# Altium project BPQ.PrjPcb
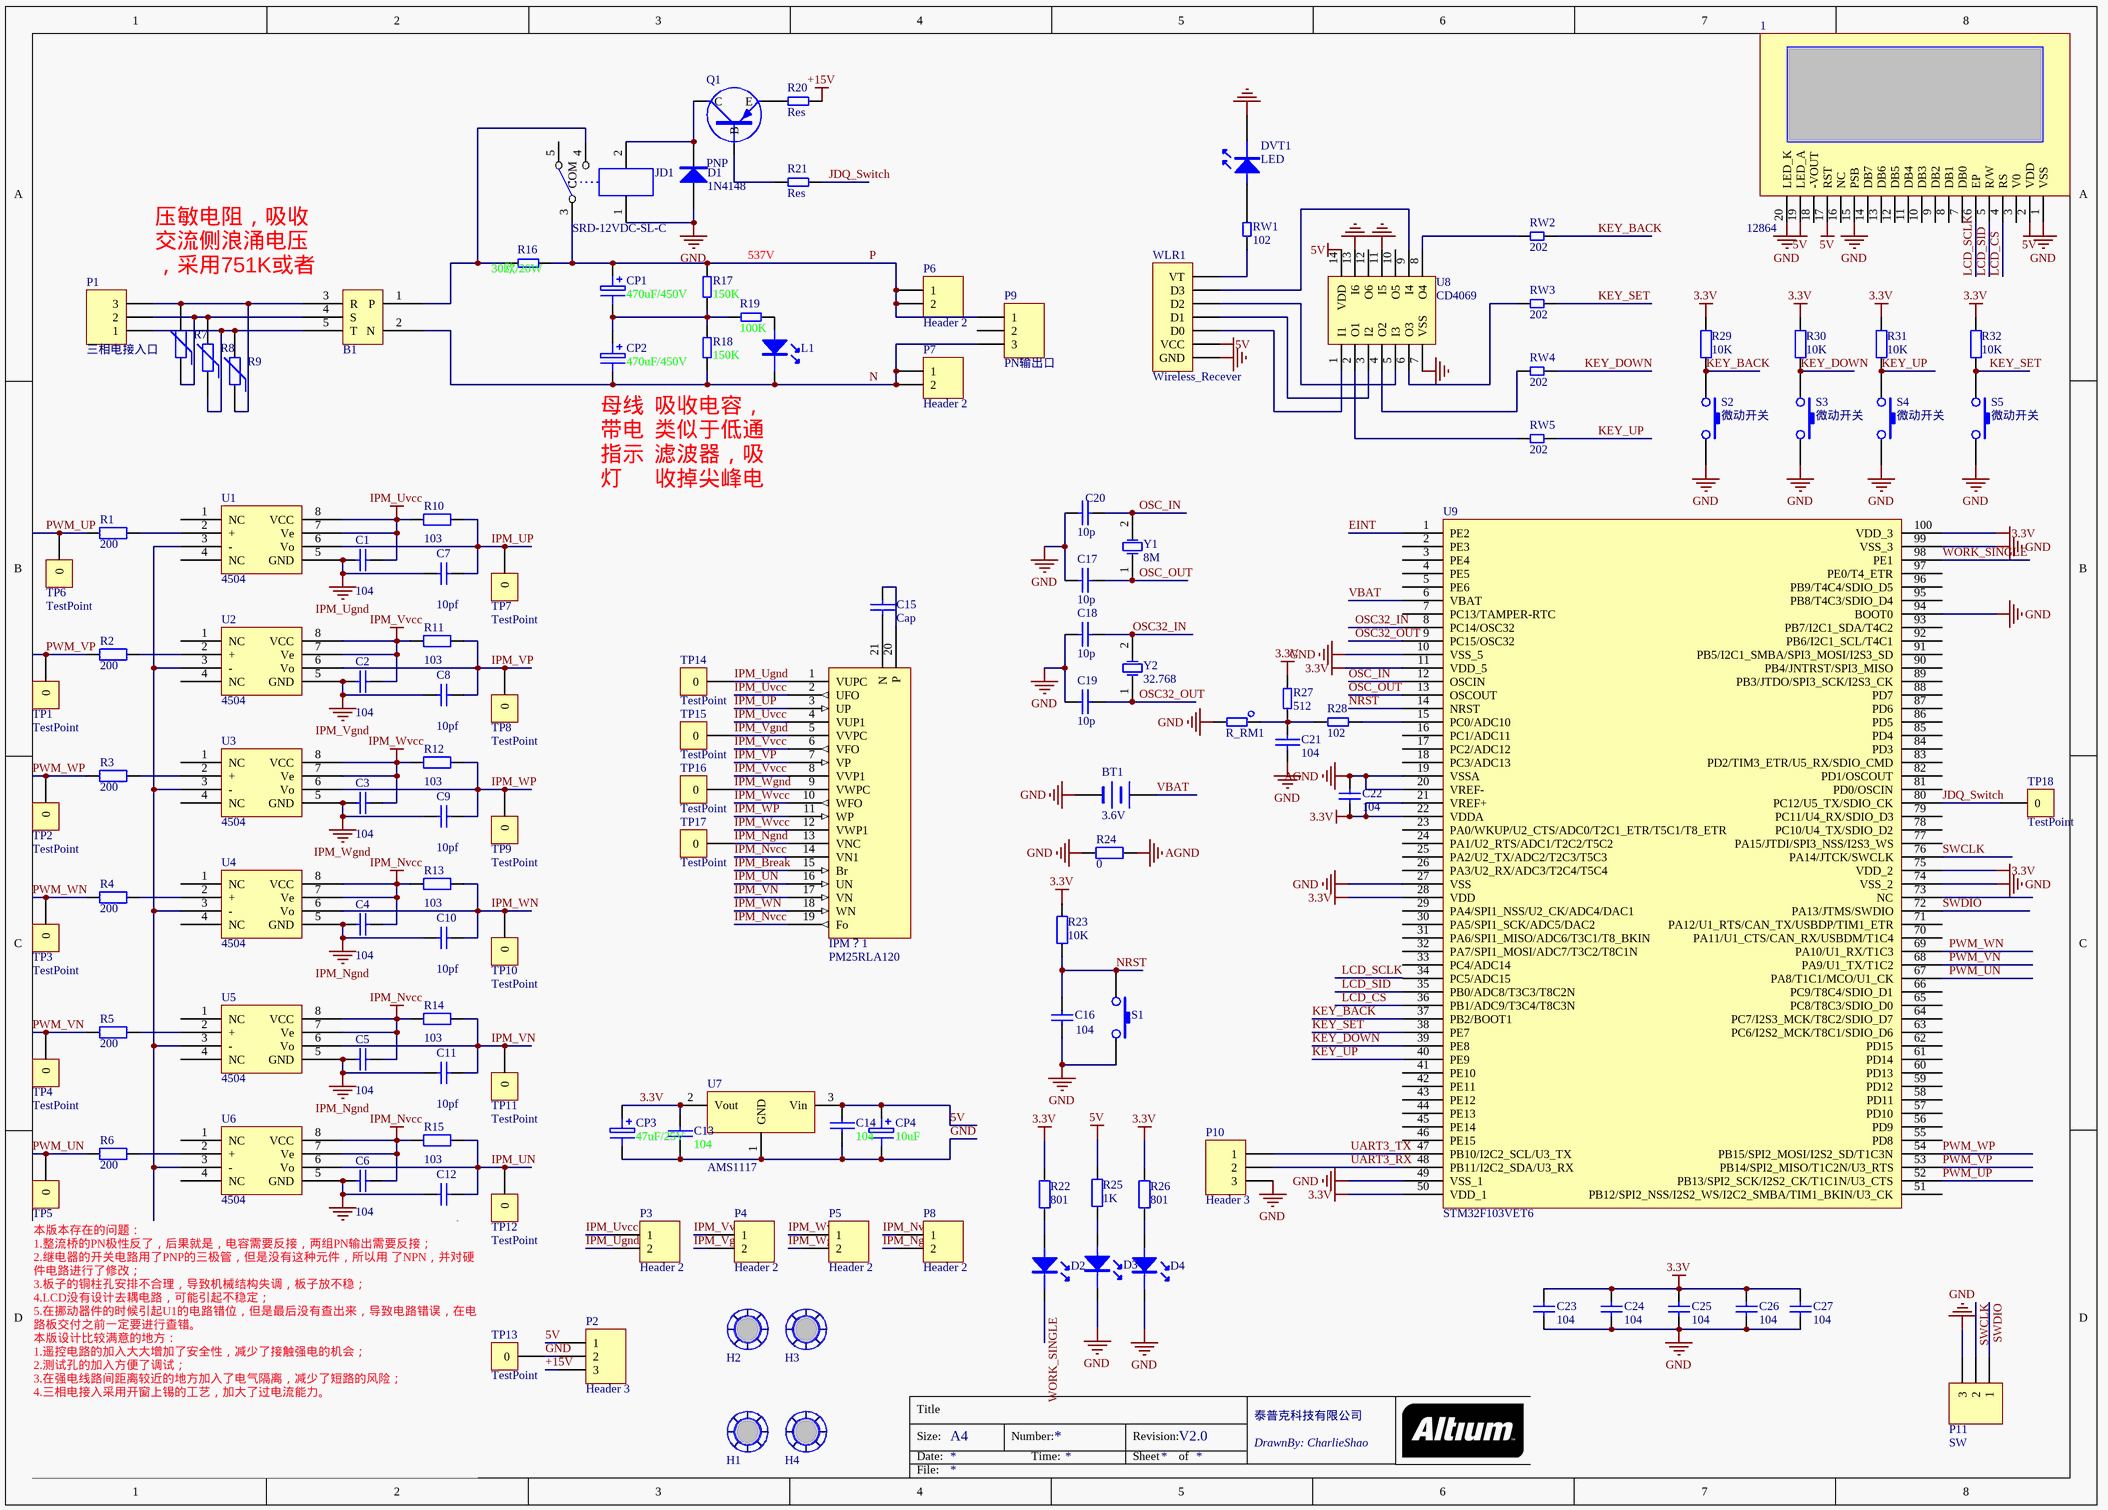
[diagram p0: BPQ.SchDoc]
1 sheet, 131 parts. Net scope: global (net labels, ports and power ports of the same name join across sheets).
Board file: BPQ.PcbDoc

## Sheet BPQ.SchDoc
size A3; Address1: 泰普克科技有限公司; Address3: DrawnBy: CharlieShao; Revision: V2.0; ProjectName: BPQ

### Parts
1  12864  [YX12864B]
B1  3BRIDGE  [三相整流桥]  (value not drawn)
BT1  3.6V  [CR1220]
C1  value 104  [0805C]  (hidden comment: Cap)
C2  value 104  [0805C]  (hidden comment: Cap)
C3  value 104  [0805C]  (hidden comment: Cap)
C4  value 104  [0805C]  (hidden comment: Cap)
C5  value 104  [0805C]  (hidden comment: Cap)
C6  value 104  [0805C]  (hidden comment: Cap)
C7  value 10pf  [0805C]  (hidden comment: Cap)
C8  value 10pf  [0805C]  (hidden comment: Cap)
C9  value 10pf  [0805C]  (hidden comment: Cap)
C10  value 10pf  [0805C]  (hidden comment: Cap)
C11  value 10pf  [0805C]  (hidden comment: Cap)
C12  value 10pf  [0805C]  (hidden comment: Cap)
C13  104  [0805C]
C14  104  [0805C]
C15  Cap  [Cap_X]
C16  104  [0805C]
C17  10p  [0805C]
C18  10p  [0805C]
C19  10p  [0805C]
C20  10p  [0805C]
C21  104  [0805C]
C22  104  [0805C]
C23  104  [0805C]
C24  104  [0805C]
C25  104  [0805C]
C26  104  [0805C]
C27  104  [0805C]
CP1  470uF/450V  [CAP_35X50]
CP2  470uF/450V  [CAP_35X50]
CP3  47uF/25V  [CAP_6.3X5.4]
CP4  10uF  [CAP_6.3X5.4]
D1  1N4148  [Diode_1206]
D2  LED  [LED_0805]  (value not drawn)
D3  LED  [LED_0805]  (value not drawn)
D4  LED  [LED_0805]  (value not drawn)
DVT1  LED  [LED_1206]
H1  铜柱孔  [HOLE]  (value not drawn)
H2  铜柱孔  [HOLE]  (value not drawn)
H3  铜柱孔  [HOLE]  (value not drawn)
H4  铜柱孔  [HOLE]  (value not drawn)
IPM？1  PM25RLA120  [PM25RLA120]
JD1  SRD-12VDC-SL-C  [SRD-12VDC-SL-C]
L1  LED  [LED_1206]  (value not drawn)
P1  三相电接入口  [30A/300V]
P2  Header 3  [HDR1X3]
P3  Header 2  [HDR1X2]
P4  Header 2  [HDR1X2]
P5  Header 2  [HDR1X2]
P6  Header 2  [HDR1X2]
P7  Header 2  [HDR1X2]
P8  Header 2  [HDR1X2]
P9  PN输出口  [30A/300V]
P10  Header 3  [HDR1X3]
P11  SW  [HDR1X3H]
Q1  PNP  [SOT23]
R1  value 200  [0805R]  (hidden comment: Res2)
R2  value 200  [0805R]  (hidden comment: Res2)
R3  value 200  [0805R]  (hidden comment: Res2)
R4  value 200  [0805R]  (hidden comment: Res2)
R5  value 200  [0805R]  (hidden comment: Res2)
R6  value 200  [0805R]  (hidden comment: Res2)
R7  Res Varistor  [R_VDR]  (value not drawn)
R8  Res Varistor  [R_VDR]  (value not drawn)
R9  Res Varistor  [R_VDR]  (value not drawn)
R10  value 103  [0805R]  (hidden comment: Res2)
R11  value 103  [0805R]  (hidden comment: Res2)
R12  value 103  [0805R]  (hidden comment: Res2)
R13  value 103  [0805R]  (hidden comment: Res2)
R14  value 103  [0805R]  (hidden comment: Res2)
R15  value 103  [0805R]  (hidden comment: Res2)
R16  30欧/20W  [R_30R/20W]
R17  150K  [AXIAL0.7]
R18  150K  [AXIAL0.7]
R19  100K  [0805R]
R20  Res  [0805R]
R21  Res  [0805R]
R22  801  [0805R]
R23  10K  [0805R]
R24  0  [0805R]
R25  1K  [0805R]
R26  801  [0805R]
R27  512  [0805R]
R28  102  [0805R]
R29  10K  [0805R]
R30  10K  [0805R]
R31  10K  [0805R]
R32  10K  [0805R]
R_RM1  热敏电阻  [R_RM]  (value not drawn)
RW1  102  [0805R]
RW2  202  [0805R]
RW3  202  [0805R]
RW4  202  [0805R]
RW5  202  [0805R]
S1  KEY  [SW_PB - 6.5x4.5]  (value not drawn)
S2  微动开关  [SW_PB - 6.5x4.5]
S3  微动开关  [SW_PB - 6.5x4.5]
S4  微动开关  [SW_PB - 6.5x4.5]
S5  微动开关  [SW_PB - 6.5x4.5]
TP1  TestPoint  [TEST-POINT]
TP2  TestPoint  [TEST-POINT]
TP3  TestPoint  [TEST-POINT]
TP4  TestPoint  [TEST-POINT]
TP5  TestPoint  [TEST-POINT]
TP6  TestPoint  [TEST-POINT]
TP7  TestPoint  [TEST-POINT]
TP8  TestPoint  [TEST-POINT]
TP9  TestPoint  [TEST-POINT]
TP10  TestPoint  [TEST-POINT]
TP11  TestPoint  [TEST-POINT]
TP12  TestPoint  [TEST-POINT]
TP13  TestPoint  [TEST-POINT]
TP14  TestPoint  [TEST-POINT]
TP15  TestPoint  [TEST-POINT]
TP16  TestPoint  [TEST-POINT]
TP17  TestPoint  [TEST-POINT]
TP18  TestPoint  [TEST-POINT]
U1  4504  [DIP-8]
U2  4504  [DIP-8]
U3  4504  [DIP-8]
U4  4504  [DIP-8]
U5  4504  [DIP-8]
U6  4504  [DIP-8]
U7  AMS1117  [SOT223]
U8  CD4069  [SO-14]
U9  STM32F103VET6  [LQFP100]
WLR1  Wireless_Recever  [Wireless_Recever]
Y1  8M  [XTAL2]
Y2  32.768  [XTAL1]

### Nets
3.3V: C13.2 C22.2 C23.1 C24.1 C25.1 C26.1 C27.1 CP3.1 R22.1 R23.2 R26.1 R27.1 R29.2 R30.2 R31.2 R32.2 U7.2(Vout) U9.11(VDD_5) U9.21(VREF+) U9.22(VDDA) U9.28(VDD) U9.50(VDD_1) U9.75(VDD_2) U9.100(VDD_3)
5V: 1.2(VDD) 1.17(RST) 1.19(LED_A) C14.2 CP4.1 P2.1 R25.1 U7.3(Vin) U8.14(VDD) WLR1.2(VCC)
+15V: P2.3 R20.2
AGND: C22.1 R24.1 U9.19(VSSA) U9.20(VREF-)
GND: 1.1(VSS) 1.15(PSB) 1.20(LED_K) BT1.2(-) C13.1 C14.1 C16.1 C17.1 C18.1 C19.1 C20.1 C21.1 C23.2 C24.2 C25.2 C26.2 C27.2 CP3.2 CP4.2 D1.1 D3.2 D4.2 DVT1.2 JD1.1 P2.2 P10.3 P11.3 R24.2 R_RM1.1 S1.2 S2.2 S3.2 S4.2 S5.2 TP13.0 U1.3(-) U2.3(-) U3.3(-) U4.3(-) U5.3(-) U6.3(-) U7.1(GND) U8.7(VSS) U8.11(I5) U8.13(I6) U9.10(VSS_5) U9.27(VSS) U9.49(VSS_1) U9.74(VSS_2) U9.94(BOOT0) U9.99(VSS_3) WLR1.1(GND)
IPM_Ngnd: C4.1 C5.1 C6.1 C10.1 C11.1 C12.1 IPM？1.13(VNC) P8.2 TP17.0 U4.5(GND) U5.5(GND) U6.5(GND)
IPM_Nvcc: C4.2 C5.2 C6.2 IPM？1.14(VN1) IPM？1.19(Fo) P8.1 R13.1 R14.1 R15.1 U4.7(Ve) U4.8(VCC) U5.7(Ve) U5.8(VCC) U6.7(Ve) U6.8(VCC)
IPM_Ugnd: C1.1 C7.1 IPM？1.1(VUPC) P3.2 TP14.0 U1.5(GND)
IPM_Uvcc: C1.2 IPM？1.2(UFO) IPM？1.4(VUP1) P3.1 R10.1 U1.7(Ve) U1.8(VCC)
IPM_Vgnd: C2.1 C8.1 IPM？1.5(VVPC) P4.2 TP15.0 U2.5(GND)
IPM_Vvcc: C2.2 IPM？1.6(VFO) IPM？1.8(VVP1) P4.1 R11.1 U2.7(Ve) U2.8(VCC)
IPM_Wgnd: C3.1 C9.1 IPM？1.9(VWPC) P5.2 TP16.0 U3.5(GND)
IPM_Wvcc: C3.2 IPM？1.10(WFO) IPM？1.12(VWP1) P5.1 R12.1 U3.7(Ve) U3.8(VCC)
EINT: U9.1(PE2)
IPM_Break: IPM？1.15(Br)
IPM_UN: C12.2 IPM？1.16(UN) R15.2 TP12.0 U6.6(Vo)
IPM_UP: C7.2 IPM？1.3(UP) R10.2 TP7.0 U1.6(Vo)
IPM_VN: C11.2 IPM？1.17(VN) R14.2 TP11.0 U5.6(Vo)
IPM_VP: C8.2 IPM？1.7(VP) R11.2 TP8.0 U2.6(Vo)
IPM_WN: C10.2 IPM？1.18(WN) R13.2 TP10.0 U4.6(Vo)
IPM_WP: C9.2 IPM？1.11(WP) R12.2 TP9.0 U3.6(Vo)
JDQ_Switch: R21.2 TP18.0 U9.80(PC12/U5_TX/SDIO_CK)
KEY_BACK: R29.1 RW2.1 S2.1 U9.37(PB2/BOOT1)
KEY_DOWN: R30.1 RW4.1 S3.1 U9.39(PE8)
KEY_SET: R32.1 RW3.1 S5.1 U9.38(PE7)
KEY_UP: R31.1 RW5.1 S4.1 U9.40(PE9)
LCD_CS: 1.4(RS) U9.36(PB1/ADC9/T3C4/T8C3N)
LCD_SCLK: 1.6(EP) U9.34(PC5/ADC15)
LCD_SID: 1.5(R/W) U9.35(PB0/ADC8/T3C3/T8C2N)
N: B1.2(N) CP2.2 L1.2 P7.1 P7.2 P9.3 R18.1
NRST: C16.2 R23.1 S1.1 U9.14(NRST)
OSC32_IN: C18.2 U9.8(PC14/OSC32) Y2.2(OSC2)
OSC32_OUT: C19.2 U9.9(PC15/OSC32) Y2.1(OSC1)
OSC_IN: C20.2 U9.12(OSCIN) Y1.2(OSC2)
OSC_OUT: C17.2 U9.13(OSCOUT) Y1.1(OSC1)
P: CP1.1 JD1.3(COM) P6.1 P6.2 P9.1 R16.2 R17.2
PWM_UN: R6.1 TP5.0 U9.67(PA8/T1C1/MCO/U1_CK)
PWM_UP: R1.1 TP6.0 U9.52(PB13/SPI2_SCK/I2S2_CK/T1C1N/U3_CTS)
PWM_VN: R5.1 TP4.0 U9.68(PA9/U1_TX/T1C2)
PWM_VP: R2.1 TP1.0 U9.53(PB14/SPI2_MISO/T1C2N/U3_RTS)
PWM_WN: R4.1 TP3.0 U9.69(PA10/U1_RX/T1C3)
PWM_WP: R3.1 TP2.0 U9.54(PB15/SPI2_MOSI/I2S2_SD/T1C3N)
SWCLK: P11.2 U9.76(PA14/JTCK/SWCLK)
SWDIO: P11.1 U9.72(PA13/JTMS/SWDIO)
UART3_RX: P10.2 U9.48(PB11/I2C2_SDA/U3_RX)
UART3_TX: P10.1 U9.47(PB10/I2C2_SCL/U3_TX)
VBAT: BT1.1(+) U9.6(VBAT)
WORK_SINGLE: D2.2 U9.98(PE1)
NetB1_1: B1.1(P) JD1.4 R16.1
NetB1_3: B1.3(R) P1.3 R7.2 R9.1
NetB1_4: B1.4(S) P1.2 R7.1 R8.2
NetB1_5: B1.5(T) P1.1 R8.1 R9.2
NetC15_1: C15.1 IPM？1.20(P)
NetC15_2: C15.2 IPM？1.21(N)
NetC21_2: C21.2 R27.2 R28.2 R_RM1.2
NetCP1_2: CP1.2 CP2.1 R17.1 R18.2 R19.2
NetD1_2: D1.2 JD1.2 Q1.C
NetD2_1: D2.1 R22.2
NetD3_1: D3.1 R25.2
NetD4_1: D4.1 R26.2
NetDVT1_1: DVT1.1 RW1.2
NetL1_1: L1.1 R19.1
NetQ1_B: Q1.B R21.1
NetQ1_E: Q1.E R20.1
NetR1_2: R1.2 U1.2(+)
NetR2_2: R2.2 U2.2(+)
NetR3_2: R3.2 U3.2(+)
NetR4_2: R4.2 U4.2(+)
NetR5_2: R5.2 U5.2(+)
NetR6_2: R6.2 U6.2(+)
NetR28_1: R28.1 U9.15(PC0/ADC10)
NetRW1_1: RW1.1 WLR1.7(VT)
NetRW2_2: RW2.2 U8.8(O4)
NetRW3_2: RW3.2 U8.6(O3)
NetRW4_2: RW4.2 U8.4(O2)
NetRW5_2: RW5.2 U8.2(O1)
NetU8_1: U8.1(I1) WLR1.3(D0)
NetU8_3: U8.3(I2) WLR1.4(D1)
NetU8_5: U8.5(I3) WLR1.5(D2)
NetU8_9: U8.9(I4) WLR1.6(D3)

Not connected (* = marked no-connect by the designer): 1 3(V0) 7(DB0) 8(DB1) 9(DB2) 10(DB3) 11(DB4) 12(DB5) 13(DB6) 14(DB7) 16(NC) 18(-VOUT); H1 0; H2 0; H3 0; H4 0; JD1 5; P9 2; U1 1(NC) 4(NC); U2 1(NC) 4(NC); U3 1(NC) 4(NC); U4 1(NC) 4(NC); U5 1(NC) 4(NC); U6 1(NC) 4(NC); U8 10(O5) 12(O6); U9 2(PE3) 3(PE4) 4(PE5) 5(PE6) 7(PC13/TAMPER-RTC) 16(PC1/ADC11) 17(PC2/ADC12) 18(PC3/ADC13) 23(PA0/WKUP/U2_CTS/ADC0/T2C1_ETR/T5C1/T8_ETR) 24(PA1/U2_RTS/ADC1/T2C2/T5C2) 25(PA2/U2_TX/ADC2/T2C3/T5C3) 26(PA3/U2_RX/ADC3/T2C4/T5C4) 29(PA4/SPI1_NSS/U2_CK/ADC4/DAC1) 30(PA5/SPI1_SCK/ADC5/DAC2) 31(PA6/SPI1_MISO/ADC6/T3C1/T8_BKIN) 32(PA7/SPI1_MOSI/ADC7/T3C2/T8C1N) 33(PC4/ADC14) 41(PE10) 42(PE11) 43(PE12) 44(PE13) 45(PE14) 46(PE15) 51(PB12/SPI2_NSS/I2S2_WS/I2C2_SMBA/TIM1_BKIN/U3_CK) 55(PD8) 56(PD9) 57(PD10) 58(PD11) 59(PD12) 60(PD13) 61(PD14) 62(PD15) 63(PC6/I2S2_MCK/T8C1/SDIO_D6) 64(PC7/I2S3_MCK/T8C2/SDIO_D7) 65(PC8/T8C3/SDIO_D0) 66(PC9/T8C4/SDIO_D1) 70(PA11/U1_CTS/CAN_RX/USBDM/T1C4) 71(PA12/U1_RTS/CAN_TX/USBDP/TIM1_ETR) 73(NC) 77(PA15/JTDI/SPI3_NSS/I2S3_WS) 78(PC10/U4_TX/SDIO_D2) 79(PC11/U4_RX/SDIO_D3) 81(PD0/OSCIN) 82(PD1/OSCOUT) 83(PD2/TIM3_ETR/U5_RX/SDIO_CMD) 84(PD3) 85(PD4) 86(PD5) 87(PD6) 88(PD7) 89(PB3/JTDO/SPI3_SCK/I2S3_CK) 90(PB4/JNTRST/SPI3_MISO) 91(PB5/I2C1_SMBA/SPI3_MOSI/I2S3_SD) 92(PB6/I2C1_SCL/T4C1) 93(PB7/I2C1_SDA/T4C2) 95(PB8/T4C3/SDIO_D4) 96(PB9/T4C4/SDIO_D5) 97(PE0/T4_ETR)

### Notes on the sheet
- 压敏电阻，吸收交流侧浪涌电压，采用751K或者821K
- 537V
- (near CP2) 母线带电指示灯
- 吸收电容，类似于低通滤波器，吸收掉尖峰电压。
- 本版本存在的问题：
  1.整流桥的PN极性反了，后果就是，电容需要反接，两组PN输出需要反接；
  2.继电器的开关电路用了PNP的三极管，但是没有这种元件，所以用 了NPN，并对硬件电路进行了修改；
  3.板子的铜柱孔安排不合理，导致机械结构失调，板子放不稳；
  4.LCD没有设计去耦电路，可能引起不稳定；
  5.在挪动器件的时候引起U1的电路错位，但是最后没有查出来，导致电路错误，在电路板交付之前一定要进行查错。
  本版设计比较满意的地方：
  1.遥控电路的加入大大增加了安全性，减少了接触强电的机会；
  2.测试孔的加入方便了调试；
  3.在强电线路间距离较近的地方加入了电气隔离，减少了短路的风险；
  4.三相电接入采用开窗上锡的工艺，加大了过电流能力。
- Title
- Size:
- Date:
- A4
- Number:
- Time:
- Revision:
- Sheet
- of
- File:

### Library data of the parts
B1 = 三相整流桥
BT1 = BATTERY: 3.6V纽扣电池
C1-C12 C16 C22-C27 = Cap: Capacitor; Published: 8-Jun-2000; LatestRevisionDate: 17-Jul-2002; LatestRevisionNote: Re-released for DXP Platform.; PackageReference: RAD-0.3; Publisher: Altium Limited
  C1-C12: PackageDescription: Radial Cap, Thru-Hole; 2 Leads; 0.3 in Pin Spacing
  C16 C22-C27: Value: 104
C13-C15 C17-C21 = Cap: 非极性电容
CP1-CP4 = Cap_Pol: 极性电容
D1 = DIODE2
IPM？1 = PM25RLA120: 三菱IPM模块25A 1200V
JD1 = SRD-12VDC-SL-C: 松乐 10A    12V继电器
L1 = LED: 发光二极管
P1 P2 P9 P10 = Header 3: Header, 3-Pin; LatestRevisionDate: 17-Jul-2002; LatestRevisionNote: Re-released for DXP Platform.; Publisher: Altium Limited
P3-P8 = Header 2: Header, 2-Pin; LatestRevisionDate: 17-Jul-2002; LatestRevisionNote: Re-released for DXP Platform.; Publisher: Altium Limited
P11 = Header 3H: Header, 3-Pin, Right Angle; LatestRevisionDate: 17-Jul-2002; LatestRevisionNote: Re-released for DXP Platform.; Publisher: Altium Limited
Q1 = PNP: PNP Transistor
R1-R6 R10-R15 R23 R25 R29-R32 = Res2: Resistor; Published: 8-Jun-2000; LatestRevisionDate: 17-Jul-2002; LatestRevisionNote: Re-released for DXP Platform.; PackageReference: AXIAL-0.4; Publisher: Altium Limited
  R1-R6 R10-R15: PackageDescription: Axial Device, Thru-Hole; 2 Leads; 0.4 in Pin Spacing
  R23 R29-R32: Value: 10K
  R25: Value: 1K
R7-R9 = Res Varistor: Varistor (Voltage-Sensitive Resistor); Published: 24-Mar-1999; LatestRevisionDate: 29-May-2009; LatestRevisionNote: IPC-7351 Footprint Added.; PackageVersion: Mar-2003; PackageReference: 6-0805; Publisher: Altium Limited; PackageDescription: Chip Resistor 0805 Case Size; Code_IPC: RESC2012
R16-R21 R27 R28 = Res: 电阻
R22 R26 = Res2: Resistor; Value: 1K; Published: 8-Jun-2000; LatestRevisionDate: 17-Jul-2002; LatestRevisionNote: Re-released for DXP Platform.; PackageReference: AXIAL-0.4; Publisher: Altium Limited
R24 = Res2: Resistor; Value: 10K; Published: 8-Jun-2000; LatestRevisionDate: 17-Jul-2002; LatestRevisionNote: Re-released for DXP Platform.; PackageReference: AXIAL-0.4; Publisher: Altium Limited
R_RM1 = Res_Temperature
RW1-RW5 = RES2
U7 = AMS1117: 三端稳压器件
WLR1 = Wireless_Recever: Connector
Y1 Y2 = XTAL: Crystal Oscillator; Published: 8-Jun-2000; LatestRevisionDate: 17-Jul-2002; LatestRevisionNote: Re-released for DXP Platform.; PackageReference: R38; Publisher: Altium Limited; PackageDescription: Crystal, Thru-Hole; 2 Leads; Body 3.1 x 8.2 mm (Dia.xH)